# Altium schematic sheet Test Plates - SMD to PLS Adapters.SchDoc: SMD to PLS adapters
size A4; Version: 1.0; Variant: Variant; Modification: Mod; Project: Test Plates
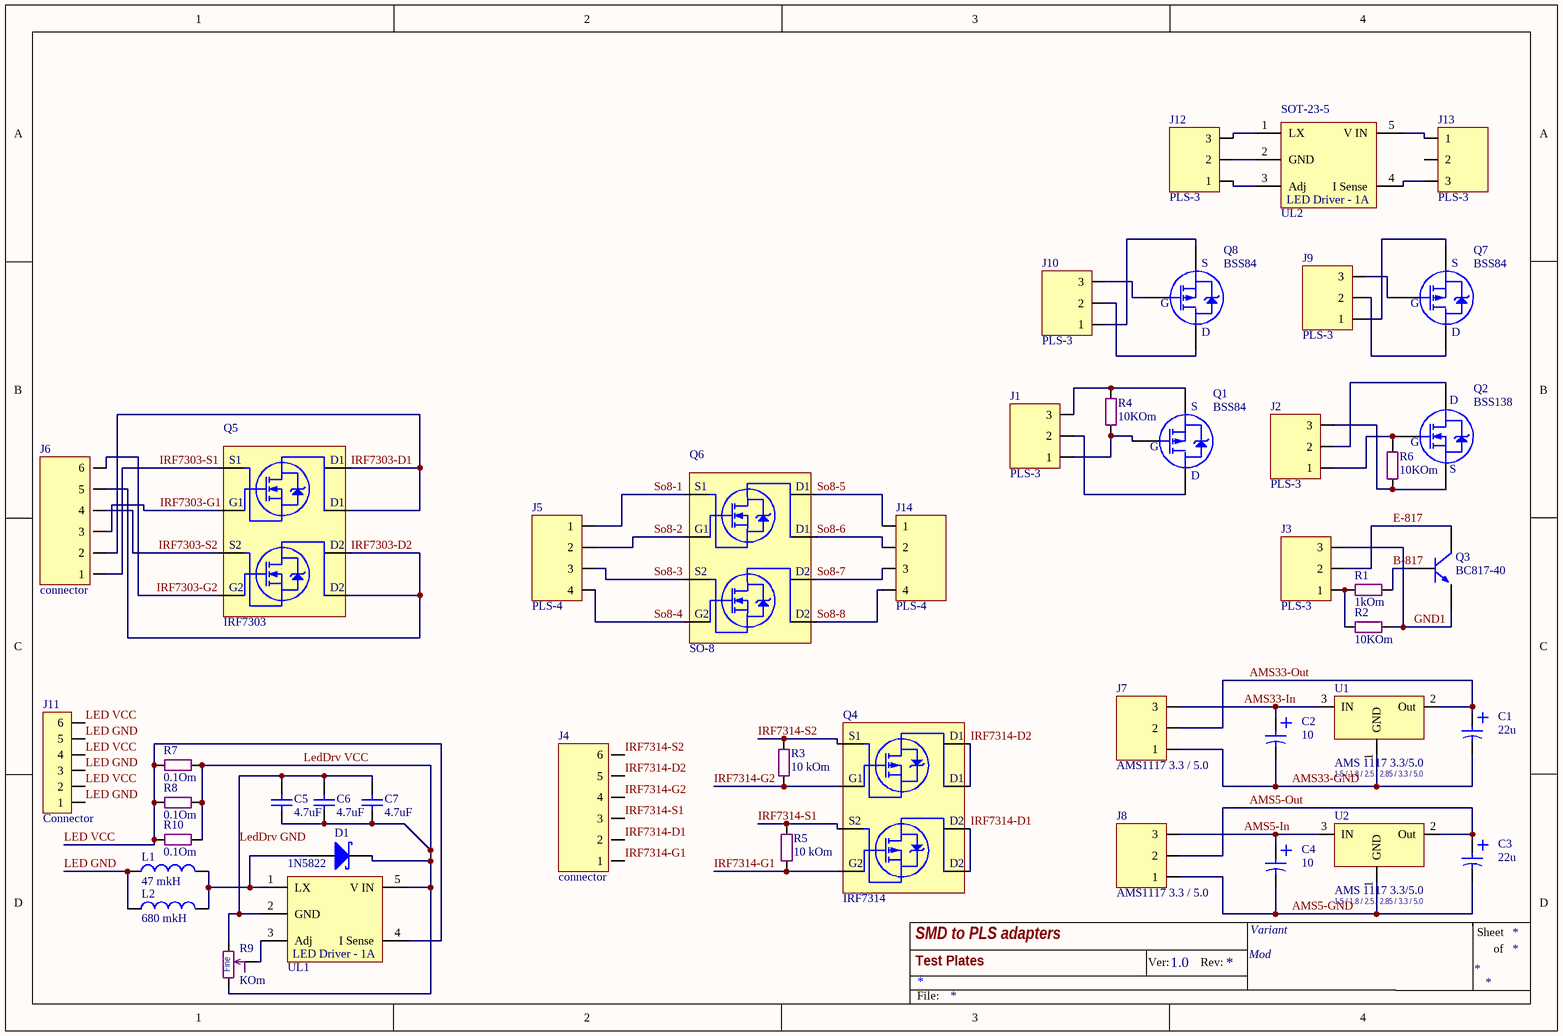
[diagram p0: Test Plates - SMD to PLS Adapters.SchDoc]

## Parts
C1  22u  [SMD 3528 Tantal (1210)]
C2  10  [SMD 1206 Tantal (3216)]
C3  22u  [SMD 3528 Tantal (1210)]
C4  10  [SMD 1206 Tantal (3216)]
C5  4.7uF  [SMD 0805 (2012)]
C6  4.7uF  [SMD 1206 (3216)]
C7  4.7uF  [Cap p2.54mm (2p)]
D1  1N5822  [Diode DO-41]
J1  PLS-3  [Line 2.54 X 3]
J2  PLS-3  [Line 2.54 X 3]
J3  PLS-3  [Line 2.54 X 3]
J4  connector  [Line 2.54 x 6]
J5  PLS-4  [Line 2.54 X 4]
J6  connector  [Line 2.54 x 6]
J7  AMS1117 3.3 / 5.0  [Line 2.54 X 3]
J8  AMS1117 3.3 / 5.0  [Line 2.54 X 3]
J9  PLS-3  [Line 2.54 X 3]
J10  PLS-3  [Line 2.54 X 3]
J11  Connector  [LINE 2.54 x 6D (2 x 3)]
J12  PLS-3  [Line 2.54 X 3]
J13  PLS-3  [Line 2.54 X 3]
J14  PLS-4  [Line 2.54 X 4]
L1  47 mkH  [47 mkH]
L2  680 mkH  [680 mkH]
Q1  BSS84  [SOT-23]
Q2  BSS138  [SOT-23]
Q3  BC817-40  [SOT-23]
Q4  IRF7314  [SO8]
Q5  IRF7303  [SO8]
Q6  SO-8  [SO8]
Q7  BSS84  [SOT-23]
Q8  BSS84  [SOT-23]
R1  1kOm  [SMD 0603 (1608)]
R2  10KOm  [SMD 0603 (1608)]
R3  10 kOm  [SMD 0805 (2012)]
R4  10KOm  [SMD 0603 (1608)]
R5  10 kOm  [SMD 0805 (2012)]
R6  10KOm  [SMD 0603 (1608)]
R7  0.1Om  [SMD 0805 (2012)]
R8  0.1Om  [Res 2W p15.24]
R9  КOm  [Res Adj 3296 Univ]
R10  0.1Om  [SMD 0805 (2012)]
U1  AMS 1117 3.3/5.0  V Out: 1.5 / 1.8 / 2.5 / 2.85 / 3.3 / 5.0  [SOT-223-3 (AMS)]
U2  AMS 1117 3.3/5.0  V Out: 1.5 / 1.8 / 2.5 / 2.85 / 3.3 / 5.0  [SOT-223-3 (AMS)]
UL1  ZXLD1360ET5TA  [SOT-23-5]  (value not drawn)
UL2  SOT-23-5  [SOT-23-5]

## Nets
AMS5-GND: C3.GND C4.GND J8.1 U2.1(GND)
AMS5-In: C4.VCC J8.3 U2.3(IN)
AMS5-Out: C3.VCC J8.2 U2.2(Out)
AMS33-GND: C1.GND C2.GND J7.1 U1.1(GND)
AMS33-In: C2.VCC J7.3 U1.3(IN)
AMS33-Out: C1.VCC J7.2 U1.2(Out)
B-817: Q3.1(B) R1.2
E-817: J3.2 Q3.3(C)
GND1: J3.3 Q3.2(E) R2.2
IRF7303-D1: J6.2 Q5.7(D) Q5.8(D)
IRF7303-D2: J6.5 Q5.5(D) Q5.6(D)
IRF7303-G1: J6.3 Q5.2(G)
IRF7303-G2: J6.6 Q5.4(G)
IRF7303-S1: J6.1 Q5.1(S)
IRF7303-S2: J6.4 Q5.3(S)
IRF7314-D1: J4.2 Q4.5(D) Q4.6(D)
IRF7314-D2: J4.5 Q4.7(D) Q4.8(D)
IRF7314-G1: J4.1 Q4.4(G) R5.1
IRF7314-G2: J4.4 Q4.2(G) R3.1
IRF7314-S1: J4.3 Q4.3(S) R5.2
IRF7314-S2: J4.6 Q4.1(S) R3.2
LED GND: J11.1 J11.3 J11.5 L1.1 L2.1
LED VCC: J11.2 J11.4 J11.6 R7.1 R8.1 R10.1 UL1.4(I_Sense)
LedDrv GND: C5.1 C6.1 C7.1 R9.3 UL1.2(GND)
LedDrv VCC: C5.2 C6.2 C7.2 D1.K R7.2 R8.2 R9.1 R10.2 UL1.5(V_IN)
So8-1: J5.1 Q6.1(S)
So8-2: J5.2 Q6.2(G)
So8-3: J5.3 Q6.3(S)
So8-4: J5.4 Q6.4(G)
So8-5: J14.1 Q6.8(D)
So8-6: J14.2 Q6.7(D)
So8-7: J14.3 Q6.6(D)
So8-8: J14.4 Q6.5(D)
NetD1_A: D1.A L1.2 L2.2 UL1.1(LX)
NetJ1_1: J1.1 Q1.1(G) R4.1
NetJ1_2: J1.2 Q1.3(D)
NetJ1_3: J1.3 Q1.2(S) R4.2
NetJ2_1: J2.1 Q2.1(G) R6.2
NetJ2_2: J2.2 Q2.2(D)
NetJ2_3: J2.3 Q2.3(S) R6.1
NetJ3_1: J3.1 R1.1 R2.1
NetJ9_1: J9.1 Q7.2(S)
NetJ9_2: J9.2 Q7.3(D)
NetJ9_3: J9.3 Q7.1(G)
NetJ10_1: J10.1 Q8.2(S)
NetJ10_2: J10.2 Q8.3(D)
NetJ10_3: J10.3 Q8.1(G)
NetJ12_1: J12.1 UL2.3(Adj)
NetJ12_2: J12.2 UL2.2(GND)
NetJ12_3: J12.3 UL2.1(LX)
NetJ13_1: J13.1 UL2.5(V_IN)
NetJ13_3: J13.3 UL2.4(I_Sense)
NetR9_2: R9.2 UL1.3(Adj)

Not connected (* = marked no-connect by the designer): J13 2

## Notes on the sheet
- Ver:
- Rev:
- Sheet
- of
- File:
- (in symbol IRF7303) S1; D1; G1; S2; D2; G2
- (in symbol IRF7314) S1; D1; G1; S2; D2; G2
- (in symbol Res Adj 3296) Fine
- (in symbol ZXLD1360ET5TA) LED Driver - 1A

## Library data of the parts
C1-C4 = Cap Tantal: Capacitor
C5 C6 = Cap SMD 0402-1812: Capacitor
C7 = Cap Ceramic: Capacitor
D1 = D Shotki All: Shotki  Diode; PackageReference: DO-201; VALUE: 1N5822
J1-J3 J7-J10 J12 J13 = PLS-3: Vert, Sgl line, Male
J4 J6 = PLS-6: Vert, Sgl line, Male
J5 J14 = PLS-4: Vert, Sgl line, Male
J11 = PLD-6 (2 x 3): Vert, Dbl line, Male
L1 = Inductor 47 mkH: Inductor; Value: 47 mkH
L2 = Inductor 680mkH: Inductor; Value: 680 mkH
Q1 Q7 Q8 = BSS84: P-Channel -50V - 10-1Ω - 0.13A; Monufacturer: Farchild; V DSS (v): 60; RDS: <10Om; Open Voltage: -0.8...-2.0 V; I d - Drain current (continuous) at TC = 25°C: 0.13 A; Name: BSS84; Datasheet: http://tec.org.ru/board/0-0-0-515-20
Q2 = BSS138: N-Channel 50V - 0.7-1Ω - 0.22A; Monufacturer: Farchild; V DSS (v): 60; RDS: <6Om; I d - Drain current (continuous) at TC = 100°C: 50 A; I d - Drain current (continuous) at TC = 25°C: 0.22 A; Name: BSS138; Datasheet: http://tec.org.ru/board/0-0-0-511-20
Q3 = BC817-40: NPN 45 V, 500 mA NPN general-purpose transistor; type: 45 V, 500 mA NPN general-purpose transistors; Name: BC817-40; url: http://lib.chipdip.ru/156/DOC000156781.pdf
Q4 = IRF7314: Dual P-Ch  20V - 0.058Ω - 5.3A; Monufacturer: IOR; RDS Сопротивление Сток-Исток: 0.058 Om; I d - Drain current (continuous) at TC = 100°C: 4.3 A; VGS Порог Открытия: -0.7 V; VGS Макс напр на гейте: +-12 V; C ISS Входная емкость: 780 pF; C OSS Выходная емкость: 470 pF; V DSS (v): 20V; I d - Drain current (continuous) at TC = 25°C: 5.3 A; Name: IRF7314; Datasheet: http://tec.org.ru/_bd/2/277_IRF7314-IR.pdf; URL: http://tec.org.ru/board/49-1-0-277
Q5 Q6 = IRF7303: Dual N-Ch  30V - 0.05Ω - 4.9A; Manufacturer: Farchild; RDS: <0.05Om; I d - Drain current (continuous) at TC = 70°C: 3.9 A; C In: 520pF; C Out: 180pF; V DSS (v): 30 v; I d - Drain current (continuous) at TC = 25°C: 4.9 A; Name: IRF7303; Datasheet: http://tec.org.ru/board/0-0-0-3164-20
R1 R2 R4 R6 = Res SMD 0603
R3 R5 R7 R8 R10 = Res All Types
R9 = Res Adj 3296
U1 U2 = AMS1117_FIX: Voltage Regulator SOT-223-3; I output (A): 1; Max Voltage In (V): 15; t: -40...+125°C; Name: AMS1117 1.5 / 1.8 / 2.5 / 2.85 / 3.3 / 5.0; Dropuot: 1-1.3V; Capacitors: In: 10mF; Out: 22mF; Case: SOT-223; Dtatsheet: https://lib.chipdip.ru/029/DOC001029248.pdf
UL1 UL2 = ZXLD1360ET5TA: Led Driver - 1A, 7-30V In; PackageDescription: SOT-23-5; ComponentLink1URL: www.zetex.com; DataSheet URL: https://lib.chipdip.ru/296/DOC000296166.pdf; Name: ZXLD1360ET5TA